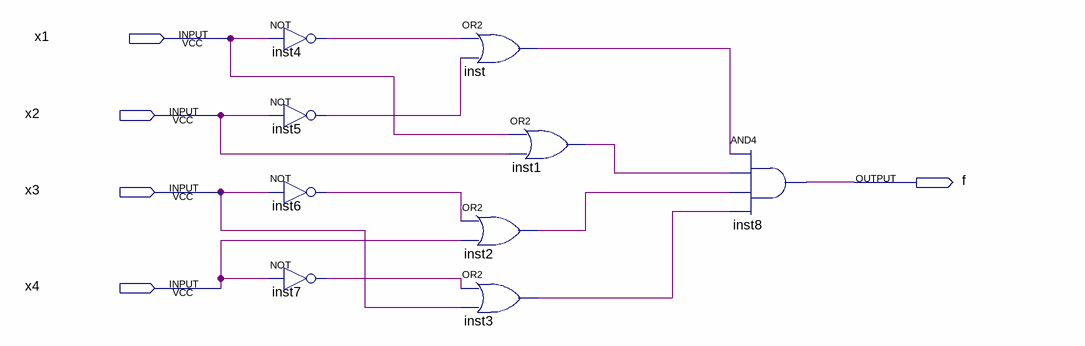
[diagram p0: schematic sheet]
// Quartus schematic Problem2.bdf as structural Verilog: 9 symbols, 5 pins
module Problem2 (
  input  x1,
  input  x2,
  input  x3,
  input  x4,
  output f
);

  wire inst1_out, inst2_out, inst3_out, inst4_out, inst5_out, inst6_out, inst7_out, inst_out;

  not inst4 (inst4_out, x1);
  not inst5 (inst5_out, x2);
  not inst6 (inst6_out, x3);
  not inst7 (inst7_out, x4);
  or inst (inst_out, inst4_out, inst5_out);
  or inst2 (inst2_out, inst6_out, x4);
  or inst3 (inst3_out, inst7_out, x3);
  or inst1 (inst1_out, x1, x2);
  and inst8 (f, inst_out, inst1_out, inst2_out, inst3_out);
endmodule
